# Altium schematic sheet WirelessPower.SchDoc
size A; SheetNumber: 4
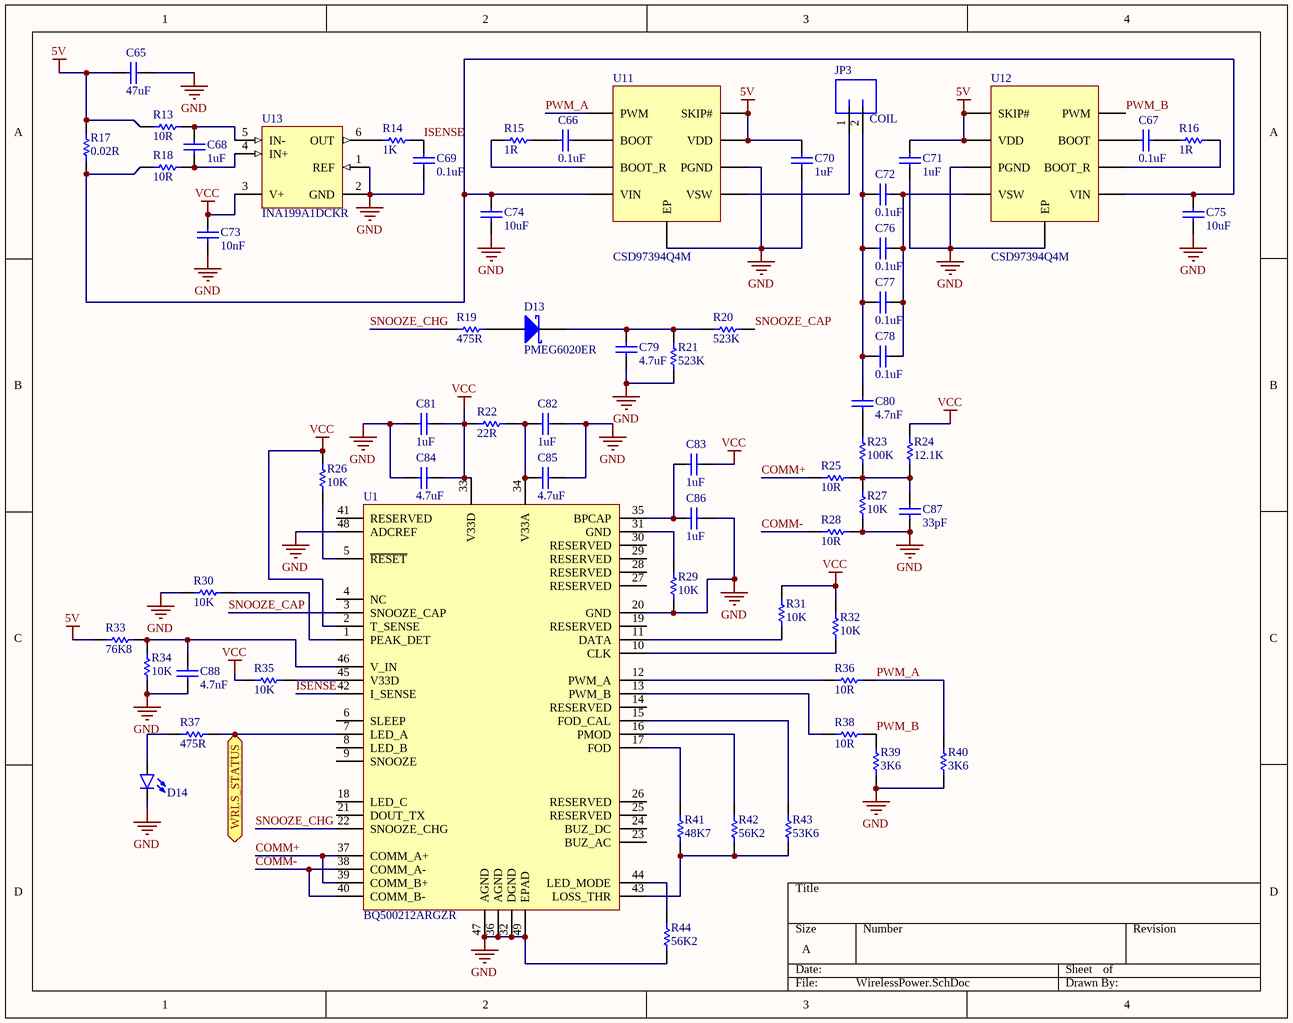
[diagram p0: WirelessPower.SchDoc]

## Parts
C65  value 47uF  [C1210[3225X250]]  (hidden comment: 47uF 6.3V 1210)
C66  value 0.1uF  [C0402[1005X55]]  (hidden comment: 0.1uF 100V 0402)
C67  value 0.1uF  [C0402[1005X55]]  (hidden comment: 0.1uF 100V 0402)
C68  value 1uF  [C0402[1005X55]]  (hidden comment: 1uF 6.3V 0402)
C69  value 0.1uF  [C0402[1005X55]]  (hidden comment: 0.1uF 6.3V 0402)
C70  value 1uF  [C0402[1005X55]]  (hidden comment: 1uF 6.3V 0402)
C71  value 1uF  [C0402[1005X55]]  (hidden comment: 1uF 6.3V 0402)
C72  value 0.1uF  [C0402[1005X55]]  (hidden comment: 0.1uF 100V 0402)
C73  value 10nF  [C0402[1005X55]]  (hidden comment: 10nF 50V 0402)
C74  value 10uF  [C0603[1608X92]]  (hidden comment: 10uF 16V 0603)
C75  value 10uF  [C0603[1608X92]]  (hidden comment: 10uF 16V 0603)
C76  value 0.1uF  [C0402[1005X55]]  (hidden comment: 0.1uF 100V 0402)
C77  value 0.1uF  [C0402[1005X55]]  (hidden comment: 0.1uF 100V 0402)
C78  value 0.1uF  [C0402[1005X55]]  (hidden comment: 0.1uF 100V 0402)
C79  value 4.7uF  [C0402[1005X55]]  (hidden comment: 4.7uF 6.3V 0402)
C80  value 4.7nF  [C0402[1005X55]]  (hidden comment: 4.7nF 50V 0402)
C81  value 1uF  [C0402[1005X55]]  (hidden comment: 1uF 6.3V 0402)
C82  value 1uF  [C0402[1005X55]]  (hidden comment: 1uF 6.3V 0402)
C83  value 1uF  [C0402[1005X55]]  (hidden comment: 1uF 6.3V 0402)
C84  value 4.7uF  [C0402[1005X55]]  (hidden comment: 4.7uF 6.3V 0402)
C85  value 4.7uF  [C0402[1005X55]]  (hidden comment: 4.7uF 6.3V 0402)
C86  value 1uF  [C0402[1005X55]]  (hidden comment: 1uF 6.3V 0402)
C87  value 33pF  [C0402[1005X55]]  (hidden comment: 33pF 50V 0402)
C88  value 4.7nF  [C0402[1005X55]]  (hidden comment: 4.7nF 50V 0402)
D13  PMEG6020ER  [SOD-123]
D14  LED_0603_GREEN_5mA  [LED0603]  (value not drawn)
JP3  COIL  [JST-SH-2-SMD-HORZ]
R13  value 10R  [R0402[1005]]  (hidden comment: 10R 1% 0402)
R14  value 1K  [R0402[1005]]  (hidden comment: 1K 1% 0402)
R15  value 1R  [R0402[1005]]  (hidden comment: 1R 1% 0402)
R16  value 1R  [R0402[1005]]  (hidden comment: 1R 1% 0402)
R17  value 0.02R  [R0805[2012]]  (hidden comment: 0.02R 1% 0805)
R18  value 10R  [R0402[1005]]  (hidden comment: 10R 1% 0402)
R19  value 475R  [R0402[1005]]  (hidden comment: 475R 1% 0402)
R20  value 523K  [R0402[1005]]  (hidden comment: 523K 1% 0402)
R21  value 523K  [R0402[1005]]  (hidden comment: 523K 1% 0402)
R22  value 22R  [R0402[1005]]  (hidden comment: 22R 1% 0402)
R23  value 100K  [R0402[1005]]  (hidden comment: 100K 1% 0402)
R24  value 12.1K  [R0402[1005]]  (hidden comment: 12.1K 1% 0402)
R25  value 10R  [R0402[1005]]  (hidden comment: 10R 1% 0402)
R26  value 10K  [R0402[1005]]  (hidden comment: 10K 1% 0402)
R27  value 10K  [R0402[1005]]  (hidden comment: 10K 1% 0402)
R28  value 10R  [R0402[1005]]  (hidden comment: 10R 1% 0402)
R29  value 10K  [R0402[1005]]  (hidden comment: 10K 1% 0402)
R30  value 10K  [R0402[1005]]  (hidden comment: 10K 1% 0402)
R31  value 10K  [R0402[1005]]  (hidden comment: 10K 1% 0402)
R32  value 10K  [R0402[1005]]  (hidden comment: 10K 1% 0402)
R33  value 76K8  [R0402[1005]]  (hidden comment: 76K8 1% 0402)
R34  value 10K  [R0402[1005]]  (hidden comment: 10K 1% 0402)
R35  value 10K  [R0402[1005]]  (hidden comment: 10K 1% 0402)
R36  value 10R  [R0402[1005]]  (hidden comment: 10R 1% 0402)
R37  value 475R  [R0402[1005]]  (hidden comment: 475R 1% 0402)
R38  value 10R  [R0402[1005]]  (hidden comment: 10R 1% 0402)
R39  value 3K6  [R0402[1005]]  (hidden comment: 3K6 1% 0402)
R40  value 3K6  [R0402[1005]]  (hidden comment: 3K6 1% 0402)
R41  value 48K7  [R0402[1005]]  (hidden comment: 48K7 1% 0402)
R42  value 56K2  [R0402[1005]]  (hidden comment: 56K2 1% 0402)
R43  value 53K6  [R0402[1005]]  (hidden comment: 53K6 1% 0402)
R44  value 56K2  [R0402[1005]]  (hidden comment: 56K2 1% 0402)
U1  BQ500212ARGZR  [QFN-48 (0.5MM)]
U11  CSD97394Q4M  [VSON-CLIP]
U12  CSD97394Q4M  [VSON-CLIP]
U13  INA199A1DCKR  [DCK0006A_M]

## Ports
WRLS_STATUS (out)

## Nets
5V: C65.1 C70.2 C71.2 R13.1 R17.2 R33.1 U11.1(SKIP#) U11.2(VDD) U12.1(SKIP#) U12.2(VDD)
GND: C65.2 C69.1 C70.1 C71.1 C73.1 C74.1 C75.1 C79.1 C81.1 C82.2 C84.1 C85.2 C86.2 C87.1 C88.1 D14.C R21.1 R27.1 R28.2 R29.1 R30.2 R34.2 R39.1 R40.1 R44.1 U1.20(GND) U1.32(DGND) U1.36(AGND) U1.47(AGND) U1.48(ADCREF) U1.49(EPAD) U11.3(PGND) U11.9(EP) U12.3(PGND) U12.9(EP) U13.1(REF) U13.2(GND)
VCC: C73.2 C81.2 C83.2 C84.2 R22.1 R24.2 R26.1 R31.2 R32.2 R35.2 U1.2(T_SENSE) U1.33(V33D) U13.3(V+)
COMM+: R25.1 U1.37(COMM_A+) U1.39(COMM_B+)
COMM-: R28.1 U1.38(COMM_A-) U1.40(COMM_B-)
ISENSE: C69.2 R14.2 U1.42(I_SENSE)
PWM_A: R36.2 R40.2 U11.8(PWM)
PWM_B: R38.2 R39.2 U12.8(PWM)
SNOOZE_CAP: R20.2 U1.3(SNOOZE_CAP)
SNOOZE_CHG: R19.1 U1.22(SNOOZE_CHG)
WRLS_STATUS: R37.2 U1.7(LED_A) ; port WRLS_STATUS
NetC66_1: C66.1 R15.2
NetC66_2: C66.2 U11.7(BOOT)
NetC67_1: C67.1 U12.7(BOOT)
NetC67_2: C67.2 R16.1
NetC68_1: C68.1 R18.2 U13.4(IN+)
NetC68_2: C68.2 R13.2 U13.5(IN-)
NetC72_1: C72.1 C76.1 C77.1 C78.1 C80.2 JP3.2
NetC72_2: C72.2 C76.2 C77.2 C78.2 U12.4(VSW)
NetC74_2: C74.2 C75.2 R17.1 R18.1 U11.5(VIN) U12.5(VIN)
NetC79_2: C79.2 D13.1(K) R20.1 R21.2
NetC80_1: C80.1 R23.2
NetC82_1: C82.1 C85.1 R22.2 U1.34(V33A)
NetC83_1: C83.1 C86.1 U1.35(BPCAP)
NetC87_2: C87.2 R23.1 R24.1 R25.2 R27.2
NetC88_2: C88.2 R33.2 R34.1 U1.46(V_IN)
NetD13_2: D13.2(A) R19.2
NetD14_A: D14.A R37.1
NetJP3_1: JP3.1 U11.4(VSW)
NetR14_1: R14.1 U13.6(OUT)
NetR15_1: R15.1 U11.6(BOOT_R)
NetR16_2: R16.2 U12.6(BOOT_R)
NetR26_2: R26.2 U1.5(~{RESET})
NetR29_2: R29.2 U1.31(GND)
NetR30_1: R30.1 U1.1(PEAK_DET)
NetR31_1: R31.1 U1.11(DATA)
NetR32_1: R32.1 U1.10(CLK)
NetR35_1: R35.1 U1.45(V33D)
NetR36_1: R36.1 U1.12(PWM_A)
NetR38_1: R38.1 U1.13(PWM_B)
NetR41_1: R41.1 R42.1 R43.1 U1.43(LOSS_THR)
NetR41_2: R41.2 U1.17(FOD)
NetR42_2: R42.2 U1.16(PMOD)
NetR43_2: R43.2 U1.15(FOD_CAL)
NetR44_2: R44.2 U1.44(LED_MODE)

Not connected (* = marked no-connect by the designer): U1 4(NC) 6(SLEEP) 8(LED_B) 9(SNOOZE) 14(RESERVED) 18(LED_C) 19(RESERVED) 21(DOUT_TX) 23(BUZ_AC) 24(BUZ_DC) 25(RESERVED) 26(RESERVED) 27(RESERVED) 28(RESERVED) 29(RESERVED) 30(RESERVED) 41(RESERVED)

## Library data of the parts
C65 = CAP_47uF_6.3V_1210_10%: 47uF 6.3V 10% 1210 (3225 Metric); PartNumber: GRM32ER70J476KE20L; Manufacturer: Murata; Mounting Technology: Surface Mount; PackageReference: 1210; PackageDescription: 1210 (3225 Metric); Voltage: 6.3V; Tolerance: 10%
C66 C67 C72 C76-C78 = CAP_0.1uF_100V_0402_10%: 0.1uF 100V 10% 0402 (1005 Metric); PartNumber: GRM155R62A104KE14D; Manufacturer: Murata; Mounting Technology: Surface Mount; PackageReference: 0402; PackageDescription: 0402 (1005 Metric); Voltage: 100V; Tolerance: 10%
C68 C70 C71 C81-C83 C86 = CAP_1uF_6.3V_0402_10%: 1uF 6.3V 10% 0402 (1005 Metric); PartNumber: GRM155R70J105KA12D; Manufacturer: Murata; Mounting Technology: Surface Mount; PackageReference: 0402; PackageDescription: 0402 (1005 Metric); Voltage: 6.3V; Tolerance: 10%
C69 = CAP_0.1uF_6.3V_0402_10%: 0.1uF 6.3V 10% 0402 (1005 Metric); PartNumber: GRM155R70J104KA01D; Manufacturer: Murata; Mounting Technology: Surface Mount; PackageReference: 0402; PackageDescription: 0402 (1005 Metric); Voltage: 6.3V; Tolerance: 10%
C73 = CAP_10nF_50V_0402_10%: 10nF 50V 10% 0402 (1005 Metric); PartNumber: GCM155R71H103KA55D; Manufacturer: Murata; Mounting Technology: Surface Mount; PackageReference: 0402; PackageDescription: 0402 (1005 Metric); Voltage: 50V; Tolerance: 10%
C74 C75 = CAP_10uF_16V_0603_10%: 10uF 16V 10% 0603 (1608 Metric); PartNumber: GRM188R61C106KAALD; Manufacturer: Murata; Mounting Technology: Surface Mount; PackageReference: 0603; PackageDescription: 0603 (1608 Metric); Voltage: 16V; Tolerance: 10%
C79 C84 C85 = CAP_4.7uF_6.3V_0402_20%: 4.7uF 6.3V 20% 0402 (1005 Metric); PartNumber: GRM155R60J475ME47D; Manufacturer: Murata; Mounting Technology: Surface Mount; PackageReference: 0402; PackageDescription: 0402 (1005 Metric); Voltage: 6.3V; Tolerance: 20%
C80 C88 = CAP_4.7nF_50V_0402_10%: 4.7nF 50V 10% 0402 (1005 Metric); PartNumber: GRM155R71H472KA01D; Manufacturer: Murata; Mounting Technology: Surface Mount; PackageReference: 0402; PackageDescription: 0402 (1005 Metric); Voltage: 50V; Tolerance: 10%
C87 = CAP_33pF_50V_0402_1%: 33pF 50V 1% 0402 (1005 Metric); PartNumber: GCM1555C1H330FA16D; Manufacturer: Murata; Mounting Technology: Surface Mount; PackageReference: 0402; PackageDescription: 0402 (1005 Metric); Voltage: 50V; Tolerance: 1%
D13 = PMEG6020ER: PartNumber: PMEG6020ER,115; Manufacturer: NXP Semiconductors; PackageDescription: SOD, 2-Leads, Body 2.69x1.6mm; PackageReference: SOD-123W; Mounting Technology: Surface Mount
D14 = LED_0603_GREEN_5mA: PartNumber: LTST-C193TGKT-5A; Manufacturer: Lite-On Inc.; PackageReference: 0603; PackageDescription: 0603 (1608 Metric); Mounting Technology: Surface Mount
JP3 = JST_SH_2_HORZ: Manufacturer: JST Sales America, Inc.; PartNumber: SM02B-SRSS-TB; Mounting Technology: Surface Mount; PackageReference: JST-SH
R13 R18 R25 R28 R36 R38 = RES_10R_0402_1%: 10R 0.063W 1% 0402 (1005 Metric); Manufacturer: KOA Speer; PartNumber: RK73H1ETTP10R0F; Tolerance: 1%; Power: 0.063W; Mounting Technology: Surface Mount; PackageReference: 0402; PackageDescription: 0402 (1005 Metric); ComponentLink1Description: Datasheet; ComponentLink1URL: http://www.koaspeer.com/catimages/Products/RK73H/RK73H.pdf
R14 = RES_1K_0402_1%: 1K 0.063W 1% 0402 (1005 Metric); Manufacturer: KOA Speer; PartNumber: RK73H1ETTP1001F; Tolerance: 1%; Power: 0.063W; Mounting Technology: Surface Mount; PackageReference: 0402; PackageDescription: 0402 (1005 Metric); ComponentLink1Description: Datasheet; ComponentLink1URL: http://www.koaspeer.com/catimages/Products/RK73H/RK73H.pdf
R15 R16 = RES_1R_0402_1%: 1R 0.063W 1% 0402 (1005 Metric); Manufacturer: KOA Speer; PartNumber: RK73H1ETTP1R00F; Tolerance: 1%; Power: 0.063W; Mounting Technology: Surface Mount; PackageReference: 0402; PackageDescription: 0402 (1005 Metric); ComponentLink1Description: Datasheet; ComponentLink1URL: http://www.koaspeer.com/catimages/Products/RK73H/RK73H.pdf
R17 = RES_0.02R_0805_1%: 0.02R 0.5W 1% 0805 (2012 Metric); Manufacturer: Bourns; PartNumber: CRF0805-FZ-R020ELF; Tolerance: 1%; Power: 0.5W; Mounting Technology: Surface Mount; PackageReference: 0805; PackageDescription: 0805 (2012 Metric)
R19 R37 = RES_475R_0402_1%: 475R 0.063W 1% 0402 (1005 Metric); Manufacturer: KOA Speer; PartNumber: RK73H1ETTP4750F; Tolerance: 1%; Power: 0.063W; Mounting Technology: Surface Mount; PackageReference: 0402; PackageDescription: 0402 (1005 Metric); ComponentLink1Description: Datasheet; ComponentLink1URL: http://www.koaspeer.com/catimages/Products/RK73H/RK73H.pdf
R20 R21 = RES_523K_0402_1%: 523K 0.063W 1% 0402 (1005 Metric); Manufacturer: KOA Speer; PartNumber: RK73H1ETTP5233F; Tolerance: 1%; Power: 0.063W; Mounting Technology: Surface Mount; PackageReference: 0402; PackageDescription: 0402 (1005 Metric); ComponentLink1Description: Datasheet; ComponentLink1URL: http://www.koaspeer.com/catimages/Products/RK73H/RK73H.pdf
R22 = RES_22R_0402_1%: 22R 0.063W 1% 0402 (1005 Metric); Manufacturer: KOA Speer; PartNumber: RK73H1ETTP22R0F; Tolerance: 1%; Power: 0.063W; Mounting Technology: Surface Mount; PackageReference: 0402; PackageDescription: 0402 (1005 Metric); ComponentLink1Description: Datasheet; ComponentLink1URL: http://www.koaspeer.com/catimages/Products/RK73H/RK73H.pdf
R23 = RES_100K_0402_1%: 100K 0.063W 1% 0402 (1005 Metric); Manufacturer: KOA Speer; PartNumber: RK73H1ETTP1003F; Tolerance: 1%; Power: 0.063W; Mounting Technology: Surface Mount; PackageReference: 0402; PackageDescription: 0402 (1005 Metric); ComponentLink1Description: Datasheet; ComponentLink1URL: http://www.koaspeer.com/catimages/Products/RK73H/RK73H.pdf
R24 = RES_12.1K_0402_1%: 12.1K 0.063W 1% 0402 (1005 Metric); Manufacturer: KOA Speer; PartNumber: RK73H1ETTP1212F; Tolerance: 1%; Power: 0.063W; Mounting Technology: Surface Mount; PackageReference: 0402; PackageDescription: 0402 (1005 Metric); ComponentLink1Description: Datasheet; ComponentLink1URL: http://www.koaspeer.com/catimages/Products/RK73H/RK73H.pdf
R26 R27 R29-R32 R34 R35 = RES_10K_0402_1%: 10K 0.063W 1% 0402 (1005 Metric); Manufacturer: KOA Speer; PartNumber: RK73H1ETTP1002F; Tolerance: 1%; Power: 0.063W; Mounting Technology: Surface Mount; PackageReference: 0402; PackageDescription: 0402 (1005 Metric); ComponentLink1Description: Datasheet; ComponentLink1URL: http://www.koaspeer.com/catimages/Products/RK73H/RK73H.pdf
R33 = RES_76K8_0402_1%: 76K8 0.063W 1% 0402 (1005 Metric); Manufacturer: KOA Speer; PartNumber: RK73H1ETTP7682F; Tolerance: 1%; Power: 0.063W; Mounting Technology: Surface Mount; PackageReference: 0402; PackageDescription: 0402 (1005 Metric); ComponentLink1Description: Datasheet; ComponentLink1URL: http://www.koaspeer.com/catimages/Products/RK73H/RK73H.pdf
R39 R40 = RES_3K6_0402_1%: 3K6 0.063W 1% 0402 (1005 Metric); Manufacturer: KOA Speer; PartNumber: RK73H1ETTP3601F; Tolerance: 1%; Power: 0.063W; Mounting Technology: Surface Mount; PackageReference: 0402; PackageDescription: 0402 (1005 Metric); ComponentLink1Description: Datasheet; ComponentLink1URL: http://www.koaspeer.com/catimages/Products/RK73H/RK73H.pdf
R41 = RES_48K7_0402_1%: 48K7 0.063W 1% 0402 (1005 Metric); Manufacturer: KOA Speer; PartNumber: RK73H1ETTP4872F; Tolerance: 1%; Power: 0.063W; Mounting Technology: Surface Mount; PackageReference: 0402; PackageDescription: 0402 (1005 Metric); ComponentLink1Description: Datasheet; ComponentLink1URL: http://www.koaspeer.com/catimages/Products/RK73H/RK73H.pdf
R42 R44 = RES_56K2_0402_1%: 56K2 0.063W 1% 0402 (1005 Metric); Manufacturer: KOA Speer; PartNumber: RK73H1ETTP5622F; Tolerance: 1%; Power: 0.063W; Mounting Technology: Surface Mount; PackageReference: 0402; PackageDescription: 0402 (1005 Metric); ComponentLink1Description: Datasheet; ComponentLink1URL: http://www.koaspeer.com/catimages/Products/RK73H/RK73H.pdf
R43 = RES_53K6_0402_1%: 53K6 0.063W 1% 0402 (1005 Metric); Manufacturer: KOA Speer; PartNumber: RK73H1ETTP5362F; Tolerance: 1%; Power: 0.063W; Mounting Technology: Surface Mount; PackageReference: 0402; PackageDescription: 0402 (1005 Metric); ComponentLink1Description: Datasheet; ComponentLink1URL: http://www.koaspeer.com/catimages/Products/RK73H/RK73H.pdf
U1 = BQ500212ARGZR: IC, Qi Compliant Wireless Power Transmitter Manager; Manufacturer: Texas Instruments; PackageReference: VQFN-48; PartNumber: BQ500212ARGZR; Mounting Technology: Surface Mount
U11 U12 = CSD97394Q4M: Manufacturer: Texas Instruments; PartNumber: CSD97394Q4M; Mounting Technology: Surface Mount; PackageReference: VSON-CLIP
U13 = CMP-0704-00049-2: Voltage Output, High or Low Side Measurement, Bi-Directional Zero-Drift Series, 2.7 to 26 V, -40 to 125 degC, 6-pin SOT23 (DCK6), Green (RoHS & no Sb/Br); Vs(Min)(V): 2.7; Small-Signal Bandwidth(Typ)(MHz): 0.03; CMRR(Min)(dB): 100; Common Mode Range(Min)(V): -0.3; Common Mode Range(Max)(V): 26; SubFamily: Current Shunt Monitor; Input Offset (+/-)(Max)(uV): 150; Gain(V/V): 50; Quiescent Current (+/-)(Typ)(mA): 0.065; Rating: Catalog; Input Offset Drift (+/-)(Max)(uV/Degrees Celsius): 0.5; Mounting Technology: Surface Mount; PackageDescription: 6-Pin Plastic Small Outline, Body 2 x 1.25 mm, Pitch 0.65 mm; PackageReference: DCK0006A; Eco-Plan: Green (RoHS & no Sb/Br); PackageVersion: 4093553-4/G, 01/2007; DatasheetVersion: SBOS469D; ComponentLink2Description: Datasheet; ComponentLink3URL: http://www.ti.com/lit/ds/symlink/ina212-q1.pdf; Code_JEDEC: MO-203; ComponentLink3Description: Package Specification; ComponentLink1URL: http://www.ti.com/; ComponentLink1Description: Manufacturer URL; Vs(Max)(V): 26; ComponentLink2URL: http://www.ti.com/general/docs/lit/getliterature.tsp?genericPartNumber=INA199A1&fileType=pdf; Output Type: Voltage; PartNumber: INA199A1DCKR